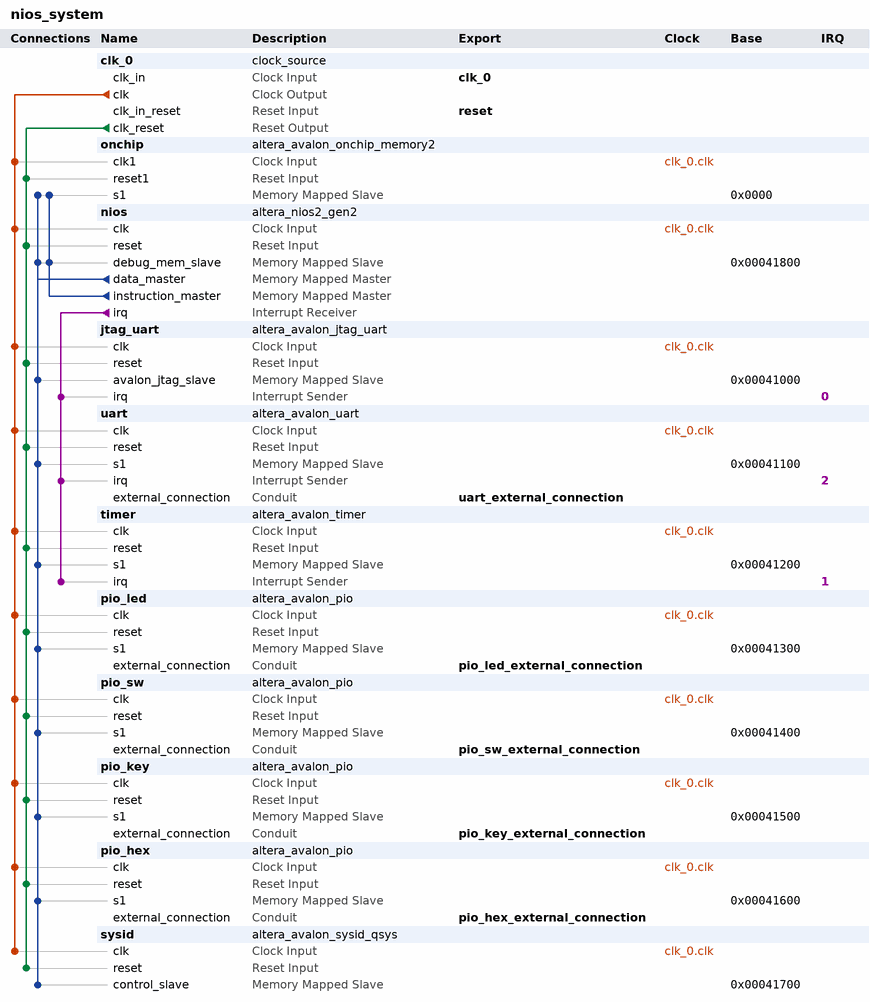
[diagram p0: system contents]
# Platform Designer (Qsys) system nios_system, Cyclone IV E EP4CE10F17C6
# Parameters at their usual value, and those the tool derives, are not listed.
package require -exact qsys 20.1
create_system nios_system
set_project_property DEVICE_FAMILY {Cyclone IV E}
set_project_property DEVICE EP4CE10F17C6

add_instance clk_0 clock_source 20.1
set_instance_parameter_value clk_0 clockFrequency 50000000

add_instance onchip altera_avalon_onchip_memory2 20.1
set_instance_parameter_value onchip dataWidth 32
set_instance_parameter_value onchip dualPort false
set_instance_parameter_value onchip initMemContent true
set_instance_parameter_value onchip initializationFileName onchip_mem.hex
set_instance_parameter_value onchip memorySize 262144

add_instance nios altera_nios2_gen2 20.1
set_instance_parameter_value nios dcache_size 2048
set_instance_parameter_value nios exceptionSlave onchip.s1
set_instance_parameter_value nios icache_size 4096
set_instance_parameter_value nios impl Fast
set_instance_parameter_value nios resetSlave onchip.s1

add_instance jtag_uart altera_avalon_jtag_uart 20.1
set_instance_parameter_value jtag_uart simInteractiveOptions NO_INTERACTIVE_WINDOWS

add_instance uart altera_avalon_uart 20.1
set_instance_parameter_value uart baud 115200
set_instance_parameter_value uart dataBits 8
set_instance_parameter_value uart fixedBaud true
set_instance_parameter_value uart parity NONE
set_instance_parameter_value uart stopBits 1

add_instance timer altera_avalon_timer 20.1
set_instance_parameter_value timer period 1
set_instance_parameter_value timer periodUnits USEC

add_instance pio_led altera_avalon_pio 20.1
set_instance_parameter_value pio_led direction Output
set_instance_parameter_value pio_led width 18

add_instance pio_sw altera_avalon_pio 20.1
set_instance_parameter_value pio_sw direction Input
set_instance_parameter_value pio_sw width 18

add_instance pio_key altera_avalon_pio 20.1
set_instance_parameter_value pio_key direction Input
set_instance_parameter_value pio_key width 4

add_instance pio_hex altera_avalon_pio 20.1
set_instance_parameter_value pio_hex direction Output
set_instance_parameter_value pio_hex width 14

add_instance sysid altera_avalon_sysid_qsys 20.1
set_instance_parameter_value sysid id 57621

# connections
add_connection clk_0.clk jtag_uart.clk clock
add_connection clk_0.clk nios.clk clock
add_connection clk_0.clk onchip.clk1 clock
add_connection clk_0.clk pio_hex.clk clock
add_connection clk_0.clk pio_key.clk clock
add_connection clk_0.clk pio_led.clk clock
add_connection clk_0.clk pio_sw.clk clock
add_connection clk_0.clk sysid.clk clock
add_connection clk_0.clk timer.clk clock
add_connection clk_0.clk uart.clk clock
add_connection clk_0.clk_reset jtag_uart.reset reset
add_connection clk_0.clk_reset nios.reset reset
add_connection clk_0.clk_reset onchip.reset1 reset
add_connection clk_0.clk_reset pio_hex.reset reset
add_connection clk_0.clk_reset pio_key.reset reset
add_connection clk_0.clk_reset pio_led.reset reset
add_connection clk_0.clk_reset pio_sw.reset reset
add_connection clk_0.clk_reset sysid.reset reset
add_connection clk_0.clk_reset timer.reset reset
add_connection clk_0.clk_reset uart.reset reset
add_connection nios.data_master jtag_uart.avalon_jtag_slave avalon
set_connection_parameter_value nios.data_master/jtag_uart.avalon_jtag_slave baseAddress 0x00041000
add_connection nios.data_master nios.debug_mem_slave avalon
set_connection_parameter_value nios.data_master/nios.debug_mem_slave baseAddress 0x00041800
add_connection nios.data_master onchip.s1 avalon
set_connection_parameter_value nios.data_master/onchip.s1 baseAddress 0x0000
add_connection nios.data_master pio_hex.s1 avalon
set_connection_parameter_value nios.data_master/pio_hex.s1 baseAddress 0x00041600
add_connection nios.data_master pio_key.s1 avalon
set_connection_parameter_value nios.data_master/pio_key.s1 baseAddress 0x00041500
add_connection nios.data_master pio_led.s1 avalon
set_connection_parameter_value nios.data_master/pio_led.s1 baseAddress 0x00041300
add_connection nios.data_master pio_sw.s1 avalon
set_connection_parameter_value nios.data_master/pio_sw.s1 baseAddress 0x00041400
add_connection nios.data_master sysid.control_slave avalon
set_connection_parameter_value nios.data_master/sysid.control_slave baseAddress 0x00041700
add_connection nios.data_master timer.s1 avalon
set_connection_parameter_value nios.data_master/timer.s1 baseAddress 0x00041200
add_connection nios.data_master uart.s1 avalon
set_connection_parameter_value nios.data_master/uart.s1 baseAddress 0x00041100
add_connection nios.instruction_master nios.debug_mem_slave avalon
set_connection_parameter_value nios.instruction_master/nios.debug_mem_slave baseAddress 0x00041800
add_connection nios.instruction_master onchip.s1 avalon
set_connection_parameter_value nios.instruction_master/onchip.s1 baseAddress 0x0000
add_connection nios.irq jtag_uart.irq interrupt
set_connection_parameter_value nios.irq/jtag_uart.irq irqNumber 0
add_connection nios.irq timer.irq interrupt
set_connection_parameter_value nios.irq/timer.irq irqNumber 1
add_connection nios.irq uart.irq interrupt
set_connection_parameter_value nios.irq/uart.irq irqNumber 2

# exported interfaces
add_interface clk_0 clock sink
set_interface_property clk_0 EXPORT_OF clk_0.clk_in
add_interface pio_hex_external_connection conduit end
set_interface_property pio_hex_external_connection EXPORT_OF pio_hex.external_connection
add_interface pio_key_external_connection conduit end
set_interface_property pio_key_external_connection EXPORT_OF pio_key.external_connection
add_interface pio_led_external_connection conduit end
set_interface_property pio_led_external_connection EXPORT_OF pio_led.external_connection
add_interface pio_sw_external_connection conduit end
set_interface_property pio_sw_external_connection EXPORT_OF pio_sw.external_connection
add_interface reset reset sink
set_interface_property reset EXPORT_OF clk_0.clk_in_reset
add_interface uart_external_connection conduit end
set_interface_property uart_external_connection EXPORT_OF uart.external_connection

set_interconnect_requirement {$system} qsys_mm.clockCrossingAdapter HANDSHAKE
set_interconnect_requirement {$system} qsys_mm.enableEccProtection FALSE
set_interconnect_requirement {$system} qsys_mm.insertDefaultSlave FALSE
set_interconnect_requirement {$system} qsys_mm.maxAdditionalLatency 1

save_system nios_system.qsys
